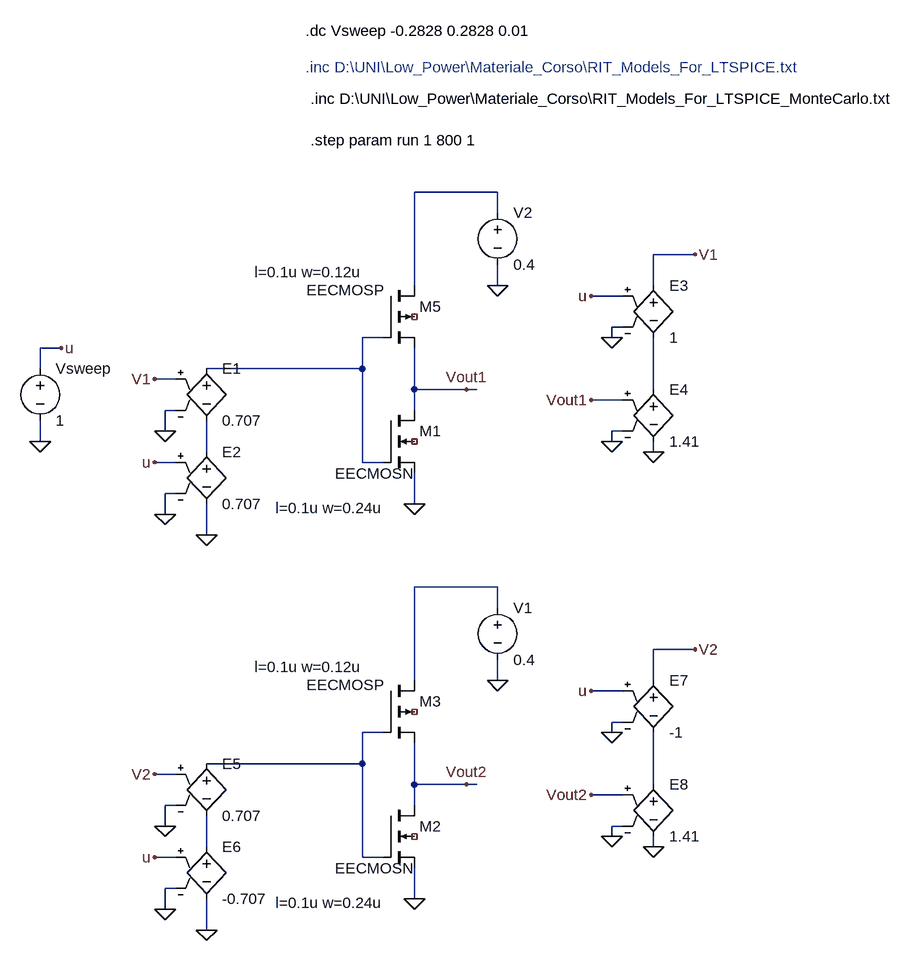
[diagram p0: schematic Draft2.asc]
Draft2.asc, the LTspice schematic file:
Version 4
SHEET 1 1096 1124
WIRE 304 -32 176 -32
WIRE 304 0 304 -32
WIRE 608 64 544 64
WIRE 176 112 176 -32
WIRE 304 112 304 80
WIRE 544 112 544 64
WIRE 496 128 448 128
WIRE 496 176 480 176
WIRE 128 192 96 192
WIRE 480 192 480 176
WIRE -368 208 -400 208
WIRE -400 240 -400 208
WIRE 96 240 96 192
WIRE 96 240 -144 240
WIRE -192 256 -224 256
WIRE 176 272 176 208
WIRE 256 272 176 272
WIRE 272 272 256 272
WIRE 544 272 544 192
WIRE 496 288 448 288
WIRE -192 304 -208 304
WIRE 176 304 176 272
WIRE -208 336 -208 304
WIRE 496 336 480 336
WIRE -400 352 -400 320
WIRE 480 352 480 336
WIRE -144 368 -144 320
WIRE 544 368 544 352
WIRE -192 384 -224 384
WIRE 96 384 96 240
WIRE 128 384 96 384
WIRE -192 432 -208 432
WIRE 176 448 176 400
WIRE -208 464 -208 432
WIRE -144 496 -144 448
WIRE 304 576 176 576
WIRE 304 608 304 576
WIRE 608 672 544 672
WIRE 176 720 176 576
WIRE 304 720 304 688
WIRE 544 720 544 672
WIRE 496 736 448 736
WIRE 496 784 480 784
WIRE 128 800 96 800
WIRE 480 800 480 784
WIRE 96 848 96 800
WIRE 96 848 -144 848
WIRE -192 864 -224 864
WIRE 176 880 176 816
WIRE 256 880 176 880
WIRE 272 880 256 880
WIRE 544 880 544 800
WIRE 496 896 448 896
WIRE -192 912 -208 912
WIRE 176 912 176 880
WIRE -208 944 -208 912
WIRE 496 944 480 944
WIRE 480 960 480 944
WIRE -144 976 -144 928
WIRE 544 976 544 960
WIRE -192 992 -224 992
WIRE 96 992 96 848
WIRE 128 992 96 992
WIRE -192 1040 -208 1040
WIRE 176 1056 176 1008
WIRE -208 1072 -208 1040
WIRE -144 1104 -144 1056
FLAG 176 448 0
FLAG 304 112 0
FLAG 256 272 Vout1
FLAG -400 352 0
FLAG -368 208 u
FLAG -144 496 0
FLAG -208 464 0
FLAG -208 336 0
FLAG -224 256 V1
FLAG -224 384 u
FLAG 544 368 0
FLAG 480 352 0
FLAG 480 192 0
FLAG 448 128 u
FLAG 448 288 Vout1
FLAG 608 64 V1
FLAG 176 1056 0
FLAG 304 720 0
FLAG 256 880 Vout2
FLAG -144 1104 0
FLAG -208 1072 0
FLAG -208 944 0
FLAG -224 864 V2
FLAG -224 992 u
FLAG 544 976 0
FLAG 480 960 0
FLAG 480 800 0
FLAG 448 736 u
FLAG 448 896 Vout2
FLAG 608 672 V2
SYMBOL nmos4 128 304 R0
WINDOW 3 -74 97 Left 2
WINDOW 123 -166 150 Left 2
SYMATTR InstName M1
SYMATTR Value EECMOSN
SYMATTR Value2 l=0.1u w=0.24u
SYMBOL pmos4 128 112 R0
WINDOW 3 -118 7 Left 2
WINDOW 123 -198 -21 Left 2
SYMATTR InstName M5
SYMATTR Value EECMOSP
SYMATTR Value2 l=0.1u w=0.12u
SYMBOL voltage 304 -16 R0
SYMATTR InstName V2
SYMATTR Value 0.4
SYMBOL voltage -400 224 R0
SYMATTR InstName Vsweep
SYMATTR Value 1
SYMBOL e -144 224 R0
SYMATTR InstName E1
SYMATTR Value 0.707
SYMBOL e -144 352 R0
SYMATTR InstName E2
SYMATTR Value 0.707
SYMBOL e 544 96 R0
SYMATTR InstName E3
SYMATTR Value 1
SYMBOL e 544 256 R0
SYMATTR InstName E4
SYMATTR Value 1.41
SYMBOL nmos4 128 912 R0
WINDOW 3 -74 97 Left 2
WINDOW 123 -166 150 Left 2
SYMATTR InstName M2
SYMATTR Value EECMOSN
SYMATTR Value2 l=0.1u w=0.24u
SYMBOL pmos4 128 720 R0
WINDOW 3 -118 7 Left 2
WINDOW 123 -198 -21 Left 2
SYMATTR InstName M3
SYMATTR Value EECMOSP
SYMATTR Value2 l=0.1u w=0.12u
SYMBOL voltage 304 592 R0
SYMATTR InstName V1
SYMATTR Value 0.4
SYMBOL e -144 832 R0
SYMATTR InstName E5
SYMATTR Value 0.707
SYMBOL e -144 960 R0
SYMATTR InstName E6
SYMATTR Value -0.707
SYMBOL e 544 704 R0
SYMATTR InstName E7
SYMATTR Value -1
SYMBOL e 544 864 R0
SYMATTR InstName E8
SYMATTR Value 1.41
TEXT 8 -280 Left 2 !.dc Vsweep -0.2828 0.2828 0.01
TEXT 8 -224 Left 2 ;.inc D:\\UNI\\Low_Power\\Materiale_Corso\\RIT_Models_For_LTSPICE.txt
TEXT 16 -176 Left 2 !.inc D:\\UNI\\Low_Power\\Materiale_Corso\\RIT_Models_For_LTSPICE_MonteCarlo.txt
TEXT 16 -112 Left 2 !.step param run 1 800 1

The netlist it stands for:
* Draft2.asc
M1 Vout1 N002 0 NC_01 EECMOSN l=0.1u w=0.24u
M5 N001 N002 Vout1 NC_02 EECMOSP l=0.1u w=0.12u
V2 N001 0 0.4
Vsweep u 0 1
E1 N002 N004 V1 0 0.707
E2 N004 0 u 0 0.707
E3 V1 N003 u 0 1
E4 N003 0 Vout1 0 1.41
M2 Vout2 N006 0 NC_03 EECMOSN l=0.1u w=0.24u
M3 N005 N006 Vout2 NC_04 EECMOSP l=0.1u w=0.12u
V1 N005 0 0.4
E5 N006 N008 V2 0 0.707
E6 N008 0 u 0 -0.707
E7 V2 N007 u 0 -1
E8 N007 0 Vout2 0 1.41
.model NMOS NMOS
.model PMOS PMOS
.lib standard.mos
.dc Vsweep -0.2828 0.2828 0.01
* .inc D:\UNI\Low_Power\Materiale_Corso\RIT_Models_For_LTSPICE.txt
.inc D:\UNI\Low_Power\Materiale_Corso\RIT_Models_For_LTSPICE_MonteCarlo.txt
.step param run 1 800 1
.backanno
.end